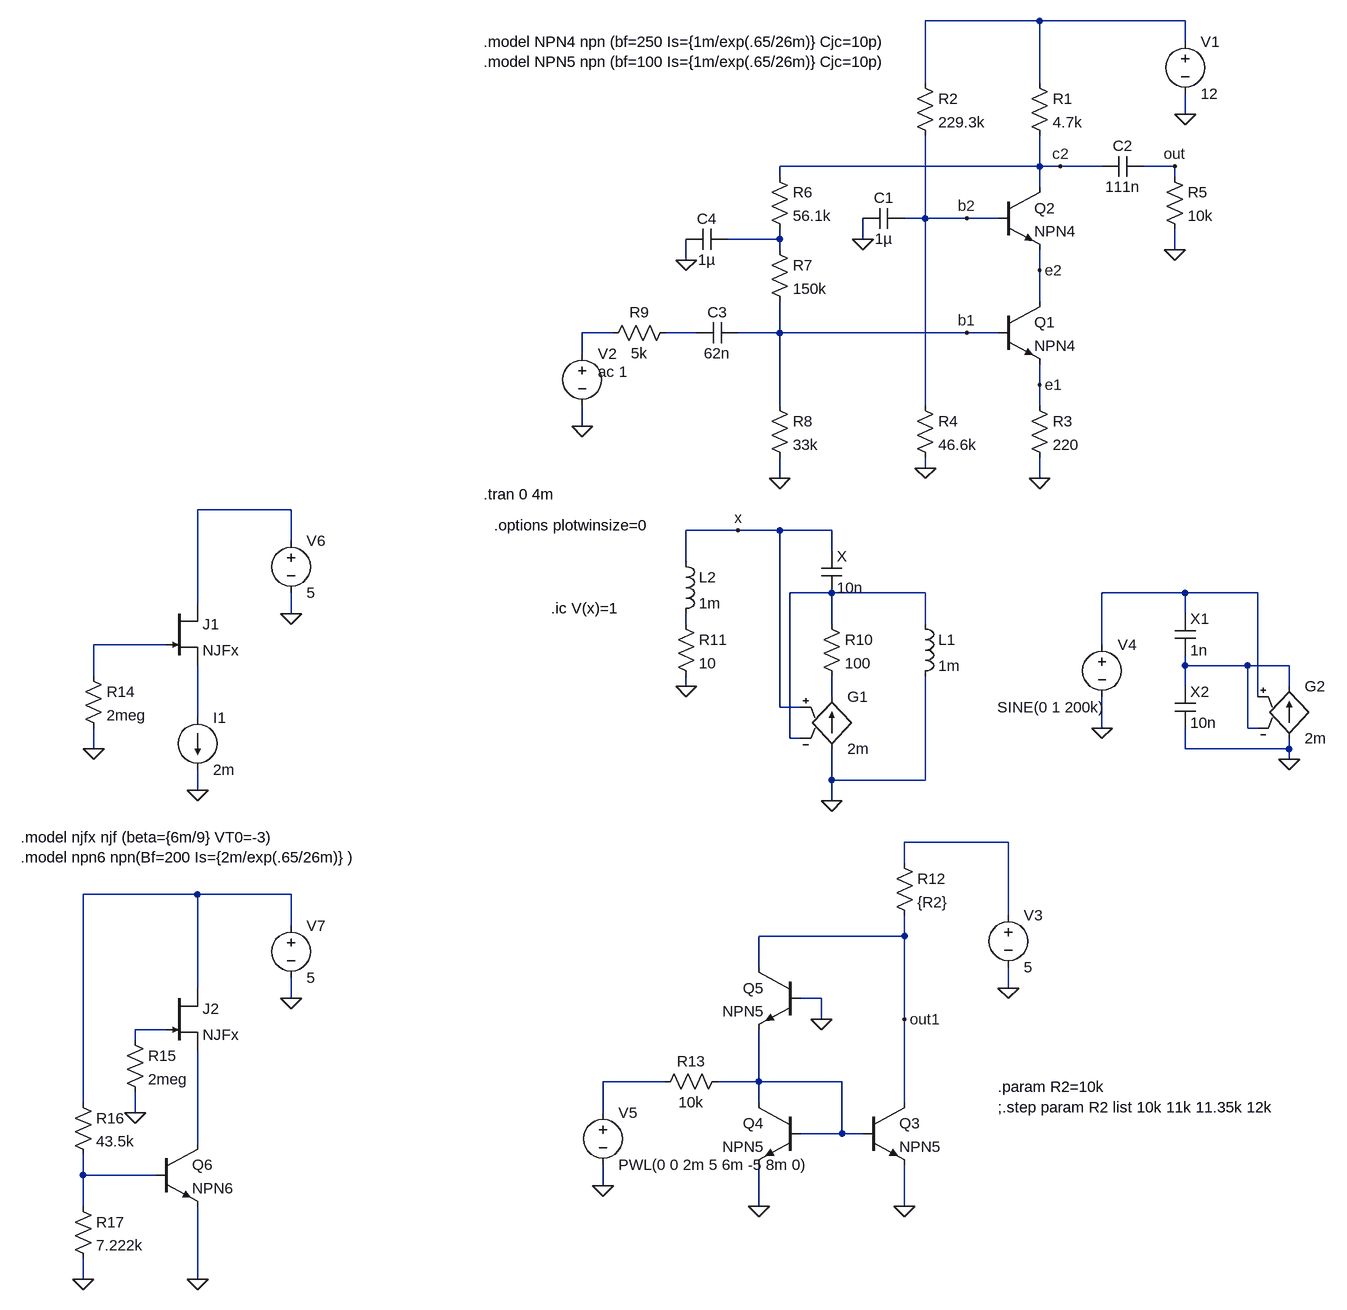
[diagram p0: schematic ws12_13_TV.asc]
ws12_13_TV.asc, the LTspice schematic file:
Version 4
SHEET 1 1556 1988
WIRE 976 32 800 32
WIRE 1200 32 976 32
WIRE 1200 64 1200 32
WIRE 800 128 800 32
WIRE 976 128 976 32
WIRE 1200 176 1200 144
WIRE 976 256 976 208
WIRE 976 256 576 256
WIRE 1008 256 976 256
WIRE 1072 256 1008 256
WIRE 1184 256 1136 256
WIRE 576 272 576 256
WIRE 1184 272 1184 256
WIRE 976 288 976 256
WIRE 800 336 800 208
WIRE 800 336 768 336
WIRE 864 336 800 336
WIRE 912 336 864 336
WIRE 576 368 576 352
WIRE 576 368 496 368
WIRE 704 368 704 336
WIRE 576 384 576 368
WIRE 1184 384 1184 352
WIRE 432 400 432 368
WIRE 976 416 976 384
WIRE 976 464 976 416
WIRE 320 512 272 512
WIRE 448 512 400 512
WIRE 576 512 576 464
WIRE 576 512 512 512
WIRE 864 512 576 512
WIRE 912 512 864 512
WIRE 272 544 272 512
WIRE 976 592 976 560
WIRE 576 624 576 512
WIRE 800 624 800 336
WIRE 976 624 976 592
WIRE 272 656 272 624
WIRE 800 720 800 704
WIRE 576 736 576 704
WIRE 976 736 976 704
WIRE -176 784 -320 784
WIRE 512 816 432 816
WIRE 576 816 512 816
WIRE 656 816 576 816
WIRE -176 832 -176 784
WIRE 656 848 656 816
WIRE 432 864 432 816
WIRE 656 912 592 912
WIRE 800 912 656 912
WIRE 1200 912 1072 912
WIRE 1312 912 1200 912
WIRE -320 928 -320 784
WIRE -176 944 -176 912
WIRE 1200 944 1200 912
WIRE 432 960 432 944
WIRE 656 960 656 912
WIRE 800 960 800 912
WIRE -368 992 -480 992
WIRE 1072 992 1072 912
WIRE 1200 1024 1200 1008
WIRE 1296 1024 1200 1024
WIRE 1360 1024 1296 1024
WIRE -480 1040 -480 992
WIRE 432 1056 432 1040
WIRE 1200 1056 1200 1024
WIRE 1360 1056 1360 1024
WIRE 656 1072 656 1040
WIRE 1312 1072 1312 912
WIRE 576 1088 576 816
WIRE 608 1088 576 1088
WIRE -320 1104 -320 1024
WIRE 1072 1120 1072 1072
WIRE 1296 1120 1296 1024
WIRE 1312 1120 1296 1120
WIRE 592 1136 592 912
WIRE 608 1136 592 1136
WIRE -480 1152 -480 1120
WIRE 1200 1152 1200 1120
WIRE 1360 1152 1360 1136
WIRE 1360 1152 1200 1152
WIRE 1360 1168 1360 1152
WIRE 656 1200 656 1152
WIRE 800 1200 800 1040
WIRE 800 1200 656 1200
WIRE -320 1216 -320 1184
WIRE 656 1232 656 1200
WIRE 928 1296 768 1296
WIRE 768 1328 768 1296
WIRE -320 1376 -496 1376
WIRE -176 1376 -320 1376
WIRE 928 1408 928 1296
WIRE -176 1424 -176 1376
WIRE 768 1440 768 1408
WIRE 768 1440 544 1440
WIRE 544 1488 544 1440
WIRE -320 1520 -320 1376
WIRE 928 1520 928 1488
WIRE -176 1536 -176 1504
WIRE 640 1536 608 1536
WIRE 640 1568 640 1536
WIRE 768 1568 768 1440
WIRE -368 1584 -416 1584
WIRE -416 1600 -416 1584
WIRE 400 1664 304 1664
WIRE 544 1664 544 1584
WIRE 544 1664 480 1664
WIRE 672 1664 544 1664
WIRE -496 1696 -496 1376
WIRE 544 1696 544 1664
WIRE 768 1696 768 1568
WIRE -416 1712 -416 1680
WIRE 304 1712 304 1664
WIRE 672 1744 672 1664
WIRE 672 1744 608 1744
WIRE 704 1744 672 1744
WIRE -320 1760 -320 1616
WIRE -496 1808 -496 1776
WIRE -384 1808 -496 1808
WIRE 304 1824 304 1792
WIRE -496 1856 -496 1808
WIRE 544 1856 544 1792
WIRE 768 1856 768 1792
WIRE -496 1968 -496 1936
WIRE -320 1968 -320 1856
FLAG 1200 176 0
FLAG 800 720 0
FLAG 272 656 0
FLAG 576 736 0
FLAG 976 736 0
FLAG 1184 384 0
FLAG 704 368 0
FLAG 432 400 0
FLAG 1008 256 c2
FLAG 976 416 e2
FLAG 976 592 e1
FLAG 864 512 b1
FLAG 864 336 b2
FLAG 656 1232 0
FLAG 512 816 x
FLAG 1360 1168 0
FLAG 1072 1120 0
FLAG 432 1056 0
FLAG 1184 256 out
FLAG 928 1520 0
FLAG 304 1824 0
FLAG 544 1856 0
FLAG 768 1856 0
FLAG 640 1568 0
FLAG 768 1568 out1
FLAG -480 1152 0
FLAG -320 1216 0
FLAG -176 944 0
FLAG -416 1712 0
FLAG -176 1536 0
FLAG -496 1968 0
FLAG -320 1968 0
SYMBOL res 960 112 R0
SYMATTR InstName R1
SYMATTR Value 4.7k
SYMBOL res 784 112 R0
SYMATTR InstName R2
SYMATTR Value 229.3k
SYMBOL voltage 1200 48 R0
WINDOW 123 0 0 Left 2
WINDOW 39 0 0 Left 2
SYMATTR InstName V1
SYMATTR Value 12
SYMBOL npn 912 288 R0
SYMATTR InstName Q2
SYMATTR Value NPN4
SYMBOL npn 912 464 R0
SYMATTR InstName Q1
SYMATTR Value NPN4
SYMBOL res 960 608 R0
SYMATTR InstName R3
SYMATTR Value 220
SYMBOL res 784 608 R0
SYMATTR InstName R4
SYMATTR Value 46.6k
SYMBOL cap 768 320 R90
WINDOW 0 0 32 VBottom 2
WINDOW 3 32 32 VTop 2
SYMATTR InstName C1
SYMATTR Value 1µ
SYMBOL cap 1136 240 R90
WINDOW 0 0 32 VBottom 2
WINDOW 3 32 32 VTop 2
SYMATTR InstName C2
SYMATTR Value 111n
SYMBOL res 1168 256 R0
SYMATTR InstName R5
SYMATTR Value 10k
SYMBOL res 560 256 R0
SYMATTR InstName R6
SYMATTR Value 56.1k
SYMBOL res 560 368 R0
SYMATTR InstName R7
SYMATTR Value 150k
SYMBOL res 560 608 R0
SYMATTR InstName R8
SYMATTR Value 33k
SYMBOL res 416 496 R90
WINDOW 0 0 56 VBottom 2
WINDOW 3 32 56 VTop 2
SYMATTR InstName R9
SYMATTR Value 5k
SYMBOL cap 512 496 R90
WINDOW 0 0 32 VBottom 2
WINDOW 3 32 32 VTop 2
SYMATTR InstName C3
SYMATTR Value 62n
SYMBOL cap 496 352 R90
WINDOW 0 0 32 VBottom 2
WINDOW 3 32 32 VTop 2
SYMATTR InstName C4
SYMATTR Value 1µ
SYMBOL voltage 272 528 R0
WINDOW 3 24 44 Left 2
WINDOW 123 0 0 Left 2
WINDOW 39 0 0 Left 2
SYMATTR Value ac 1
SYMATTR InstName V2
SYMBOL cap 640 848 R0
SYMATTR InstName X
SYMATTR Value 10n
SYMBOL res 640 944 R0
SYMATTR InstName R10
SYMATTR Value 100
SYMBOL ind 784 944 R0
SYMATTR InstName L1
SYMATTR Value 1m
SYMBOL g 656 1056 R0
SYMATTR InstName G1
SYMATTR Value 2m
SYMBOL cap 1184 944 R0
SYMATTR InstName X1
SYMATTR Value 1n
SYMBOL g 1360 1040 R0
SYMATTR InstName G2
SYMATTR Value 2m
SYMBOL cap 1184 1056 R0
SYMATTR InstName X2
SYMATTR Value 10n
SYMBOL voltage 1072 976 R0
WINDOW 3 -161 112 Left 2
WINDOW 123 24 124 Left 2
WINDOW 39 0 0 Left 2
SYMATTR Value SINE(0 1 200k)
SYMATTR InstName V4
SYMBOL ind 416 848 R0
SYMATTR InstName L2
SYMATTR Value 1m
SYMBOL res 416 944 R0
SYMATTR InstName R11
SYMATTR Value 10
SYMBOL npn 704 1696 R0
SYMATTR InstName Q3
SYMATTR Value NPN5
SYMBOL npn 608 1696 M0
SYMATTR InstName Q4
SYMATTR Value NPN5
SYMBOL res 752 1312 R0
SYMATTR InstName R12
SYMATTR Value {R2}
SYMBOL voltage 928 1392 R0
WINDOW 123 0 0 Left 2
WINDOW 39 0 0 Left 2
SYMATTR InstName V3
SYMATTR Value 5
SYMBOL npn 608 1488 M0
SYMATTR InstName Q5
SYMATTR Value NPN5
SYMBOL res 496 1648 R90
WINDOW 0 0 56 VBottom 2
WINDOW 3 32 56 VTop 2
SYMATTR InstName R13
SYMATTR Value 10k
SYMBOL voltage 304 1696 R0
WINDOW 123 0 0 Left 2
WINDOW 39 0 0 Left 2
SYMATTR InstName V5
SYMATTR Value PWL(0 0 2m 5 6m -5 8m 0)
SYMBOL voltage -176 816 R0
WINDOW 123 0 0 Left 2
WINDOW 39 0 0 Left 2
SYMATTR InstName V6
SYMATTR Value 5
SYMBOL current -320 1104 R0
WINDOW 123 0 0 Left 2
WINDOW 39 0 0 Left 2
SYMATTR InstName I1
SYMATTR Value 2m
SYMBOL njf -368 928 R0
SYMATTR InstName J1
SYMATTR Value NJFx
SYMBOL res -496 1024 R0
SYMATTR InstName R14
SYMATTR Value 2meg
SYMBOL npn -384 1760 R0
SYMATTR InstName Q6
SYMATTR Value NPN6
SYMBOL voltage -176 1408 R0
WINDOW 123 0 0 Left 2
WINDOW 39 0 0 Left 2
SYMATTR InstName V7
SYMATTR Value 5
SYMBOL njf -368 1520 R0
SYMATTR InstName J2
SYMATTR Value NJFx
SYMBOL res -432 1584 R0
SYMATTR InstName R15
SYMATTR Value 2meg
SYMBOL res -512 1680 R0
SYMATTR InstName R16
SYMATTR Value 43.5k
SYMBOL res -512 1840 R0
SYMATTR InstName R17
SYMATTR Value 7.222k
TEXT 120 64 Left 2 !.model NPN4 npn (bf=250 Is={1m/exp(.65/26m)} Cjc=10p)\n.model NPN5 npn (bf=100 Is={1m/exp(.65/26m)} Cjc=10p)
TEXT 120 760 Left 2 !.tran 0 4m
TEXT 136 808 Left 2 !.options plotwinsize=0
TEXT 224 936 Left 2 !.ic V(x)=1
TEXT 912 1672 Left 2 !.param R2=10k\n;.step param R2 list 10k 11k 11.35k 12k
TEXT -592 1288 Left 2 !.model njfx njf (beta={6m/9} VT0=-3)\n.model npn6 npn(Bf=200 Is={2m/exp(.65/26m)} )

The netlist it stands for:
* ws12_13_TV.asc
R1 N001 c2 4.7k
R2 N001 b2 229.3k
V1 N001 0 12
Q2 c2 b2 e2 0 NPN4
Q1 e2 b1 e1 0 NPN4
R3 e1 0 220
R4 b2 0 46.6k
C1 b2 0 1µ
C2 out c2 111n
R5 out 0 10k
R6 c2 N002 56.1k
R7 N002 b1 150k
R8 b1 0 33k
R9 N004 N003 5k
C3 b1 N004 62n
C4 N002 0 1µ
V2 N003 0 ac 1
C§X x N006 10n
R10 N006 N011 100
L1 N006 0 1m
G1 0 N011 x N006 2m
C§X1 N007 N010 1n
G2 0 N010 N007 N010 2m
C§X2 N010 0 10n
V4 N007 0 SINE(0 1 200k)
L2 x N008 1m
R11 N008 0 10
Q3 out1 N017 0 0 NPN5
Q4 N017 N017 0 0 NPN5
R12 N013 out1 {R2}
V3 N013 0 5
Q5 out1 0 N017 0 NPN5
R13 N017 N016 10k
V5 N016 0 PWL(0 0 2m 5 6m -5 8m 0)
V6 N005 0 5
I1 N012 0 2m
J1 N005 N009 N012 NJFx
R14 N009 0 2meg
Q6 N018 N019 0 0 NPN6
V7 N014 0 5
J2 N014 N015 N018 NJFx
R15 N015 0 2meg
R16 N014 N019 43.5k
R17 N019 0 7.222k
.model NPN NPN
.model PNP PNP
.lib standard.bjt
.model NJF NJF
.model PJF PJF
.lib standard.jft
.model NPN4 npn (bf=250 Is={1m/exp(.65/26m)} Cjc=10p)
.model NPN5 npn (bf=100 Is={1m/exp(.65/26m)} Cjc=10p)
.tran 0 4m
.options plotwinsize=0
.ic V(x)=1
.param R2=10k
;.step param R2 list 10k 11k 11.35k 12k
.model njfx njf (beta={6m/9} VT0=-3)
.model npn6 npn(Bf=200 Is={2m/exp(.65/26m)} )
.backanno
.end